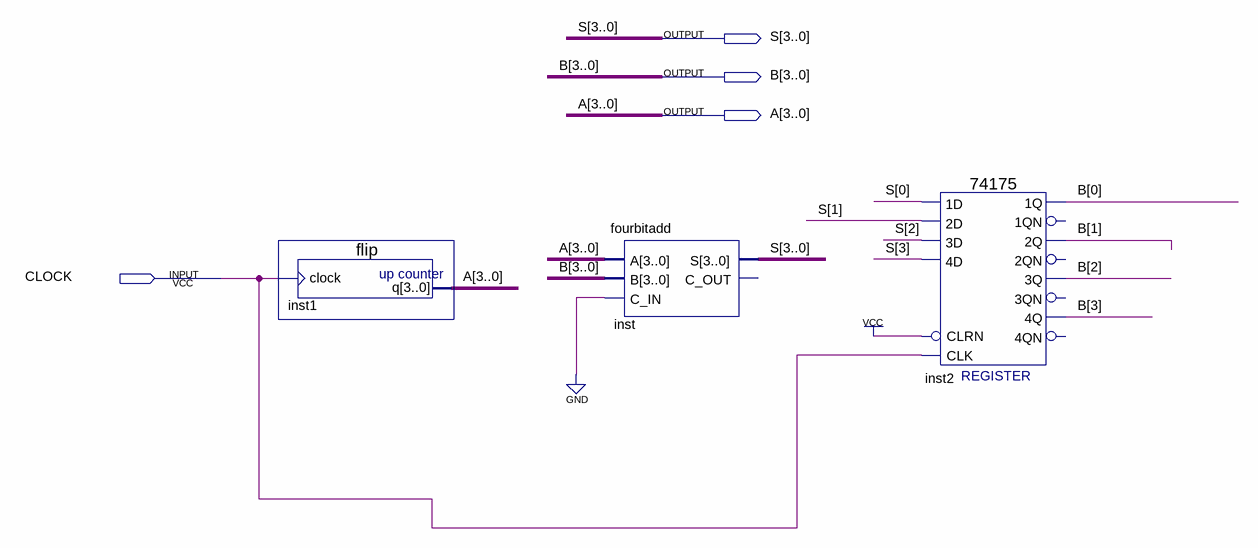
[diagram p0: schematic sheet]
// Quartus schematic flipfinal.bdf as structural Verilog: 3 symbols, 4 pins
module flipfinal (
  input  CLOCK,
  output [3:0] S,
  output [3:0] B,
  output [3:0] A
);

  flip inst1 (.clock(CLOCK), .q(A));
  fourbitadd inst (.A(A), .B(B), .C_IN(1'b0), .S(S));  // open: C_OUT
  \74175  inst2 (
    .CLRN(1'b1), .CLK(CLOCK), .\3D (S[2]), .\2D (S[1]), .\1D (S[0]), .\4D (S[3]), .\1Q (B[0]), .\3Q (B[2]),
    .\2Q (B[1]), .\4Q (B[3]));  // open: 1QN, 2QN, 4QN, 3QN
endmodule
